# EAGLE schematic switch (EAGLE 7.2.0)
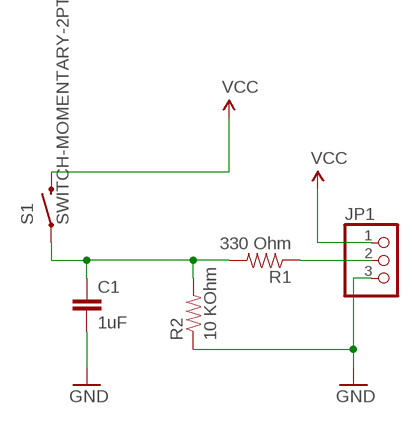
[diagram p0: schematic, sheet 1]

## Parts
C1  1uF  CAPPTH1  [CAP-PTH-5MM]
JP1  PINHD-1X3  [1X03]
R1  330 Ohm  RESISTORPTH-1/4W  [AXIAL-0.4]
R2  10 KOhm  RESISTORPTH-1/4W  [AXIAL-0.4]
S1  SWITCH-MOMENTARY-2PTH  [TACTILE-PTH]

## Nets
GND: C1.2 JP1.3 R2.P$1
N$1: JP1.2 R1.P$1
N$2: C1.1 R1.P$2 R2.P$2 S1.1
VCC: JP1.1 S1.4

## Library data of the parts
C1 = SparkFun-Capacitors:CAP: Capacitor Standard 0603 ceramic capacitor, and 0.1" leaded capacitor.
JP1 = pinhead:PINHD-1X3: PIN HEADER
R1 R2 = SparkFun-Passives:RESISTOR: Resistor Basic schematic elements and footprints for 0603, 1206, and PTH resistors.
S1 = SparkFun-Electromechanical:SWITCH-MOMENTARY-2: Various NO switches- pushbuttons, reed, etc